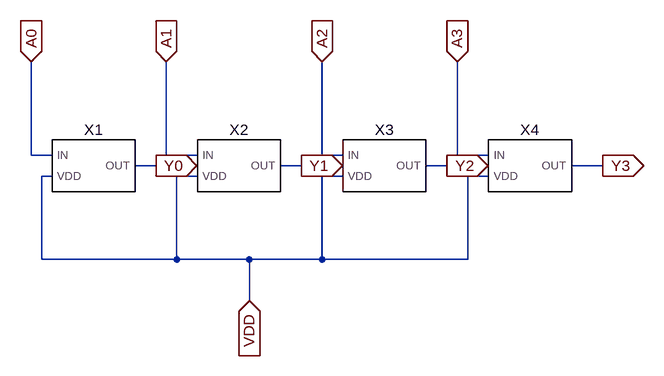
[diagram p0: schematic NOT4.asc]
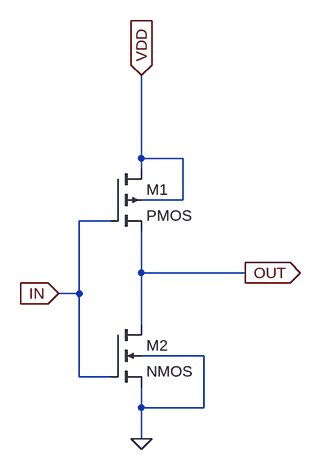
[diagram p1: sub-circuit not1.asc]
NOT4.asc, the LTspice schematic file:
Version 4.1
SHEET 1 920 680
WIRE -48 144 -48 0
WIRE -16 144 -48 144
WIRE 160 144 160 0
WIRE 208 144 160 144
WIRE 400 144 400 0
WIRE 432 144 400 144
WIRE 608 144 608 0
WIRE 656 144 608 144
WIRE 144 160 112 160
WIRE 368 160 336 160
WIRE 592 160 560 160
WIRE 832 160 784 160
WIRE -16 176 -32 176
WIRE 208 176 176 176
WIRE 432 176 400 176
WIRE 656 176 624 176
WIRE -32 304 -32 176
WIRE 176 304 176 176
WIRE 176 304 -32 304
WIRE 288 304 176 304
WIRE 400 304 400 176
WIRE 400 304 288 304
WIRE 624 304 624 176
WIRE 624 304 400 304
WIRE 288 368 288 304
FLAG -48 0 A0
IOPIN -48 0 In
FLAG 160 0 A1
IOPIN 160 0 In
FLAG 400 0 A2
IOPIN 400 0 In
FLAG 608 0 A3
IOPIN 608 0 In
FLAG 144 160 Y0
IOPIN 144 160 Out
FLAG 368 160 Y1
IOPIN 368 160 Out
FLAG 592 160 Y2
IOPIN 592 160 Out
FLAG 832 160 Y3
IOPIN 832 160 Out
FLAG 288 368 VDD
IOPIN 288 368 In
SYMBOL NOT1 48 160 R0
SYMATTR InstName X1
SYMBOL NOT1 272 160 R0
SYMATTR InstName X2
SYMBOL NOT1 496 160 R0
SYMATTR InstName X3
SYMBOL NOT1 720 160 R0
SYMATTR InstName X4

not1.asc, the sub-circuit schematic file:
Version 4.1
SHEET 1 880 680
WIRE 240 176 240 48
WIRE 304 176 240 176
WIRE 240 192 240 176
WIRE 304 240 304 176
WIRE 304 240 240 240
WIRE 192 272 144 272
WIRE 240 352 240 288
WIRE 400 352 240 352
WIRE 144 384 144 272
WIRE 144 384 112 384
WIRE 240 432 240 352
WIRE 336 480 240 480
WIRE 144 512 144 384
WIRE 192 512 144 512
WIRE 240 560 240 528
WIRE 336 560 336 480
WIRE 336 560 240 560
WIRE 240 608 240 560
FLAG 240 608 0
FLAG 112 384 IN
IOPIN 112 384 In
FLAG 400 352 OUT
IOPIN 400 352 Out
FLAG 240 48 VDD
IOPIN 240 48 In
SYMBOL pmos4 192 192 R0
SYMATTR InstName M1
SYMBOL nmos4 192 432 R0
SYMATTR InstName M2

The netlist it stands for:
* NOT4.asc
X§X1 A0 VDD Y0 not1
X§X2 A1 VDD Y1 not1
X§X3 A2 VDD Y2 not1
X§X4 A3 VDD Y3 not1

* block symbol definitions
.subckt not1 IN VDD OUT
M1 VDD IN OUT VDD PMOS
M2 OUT IN 0 0 NMOS
.ends not1

.model NMOS NMOS
.model PMOS PMOS
.lib standard.mos
.backanno
.end